# EAGLE design EDUPIC (EAGLE 6.5.0)
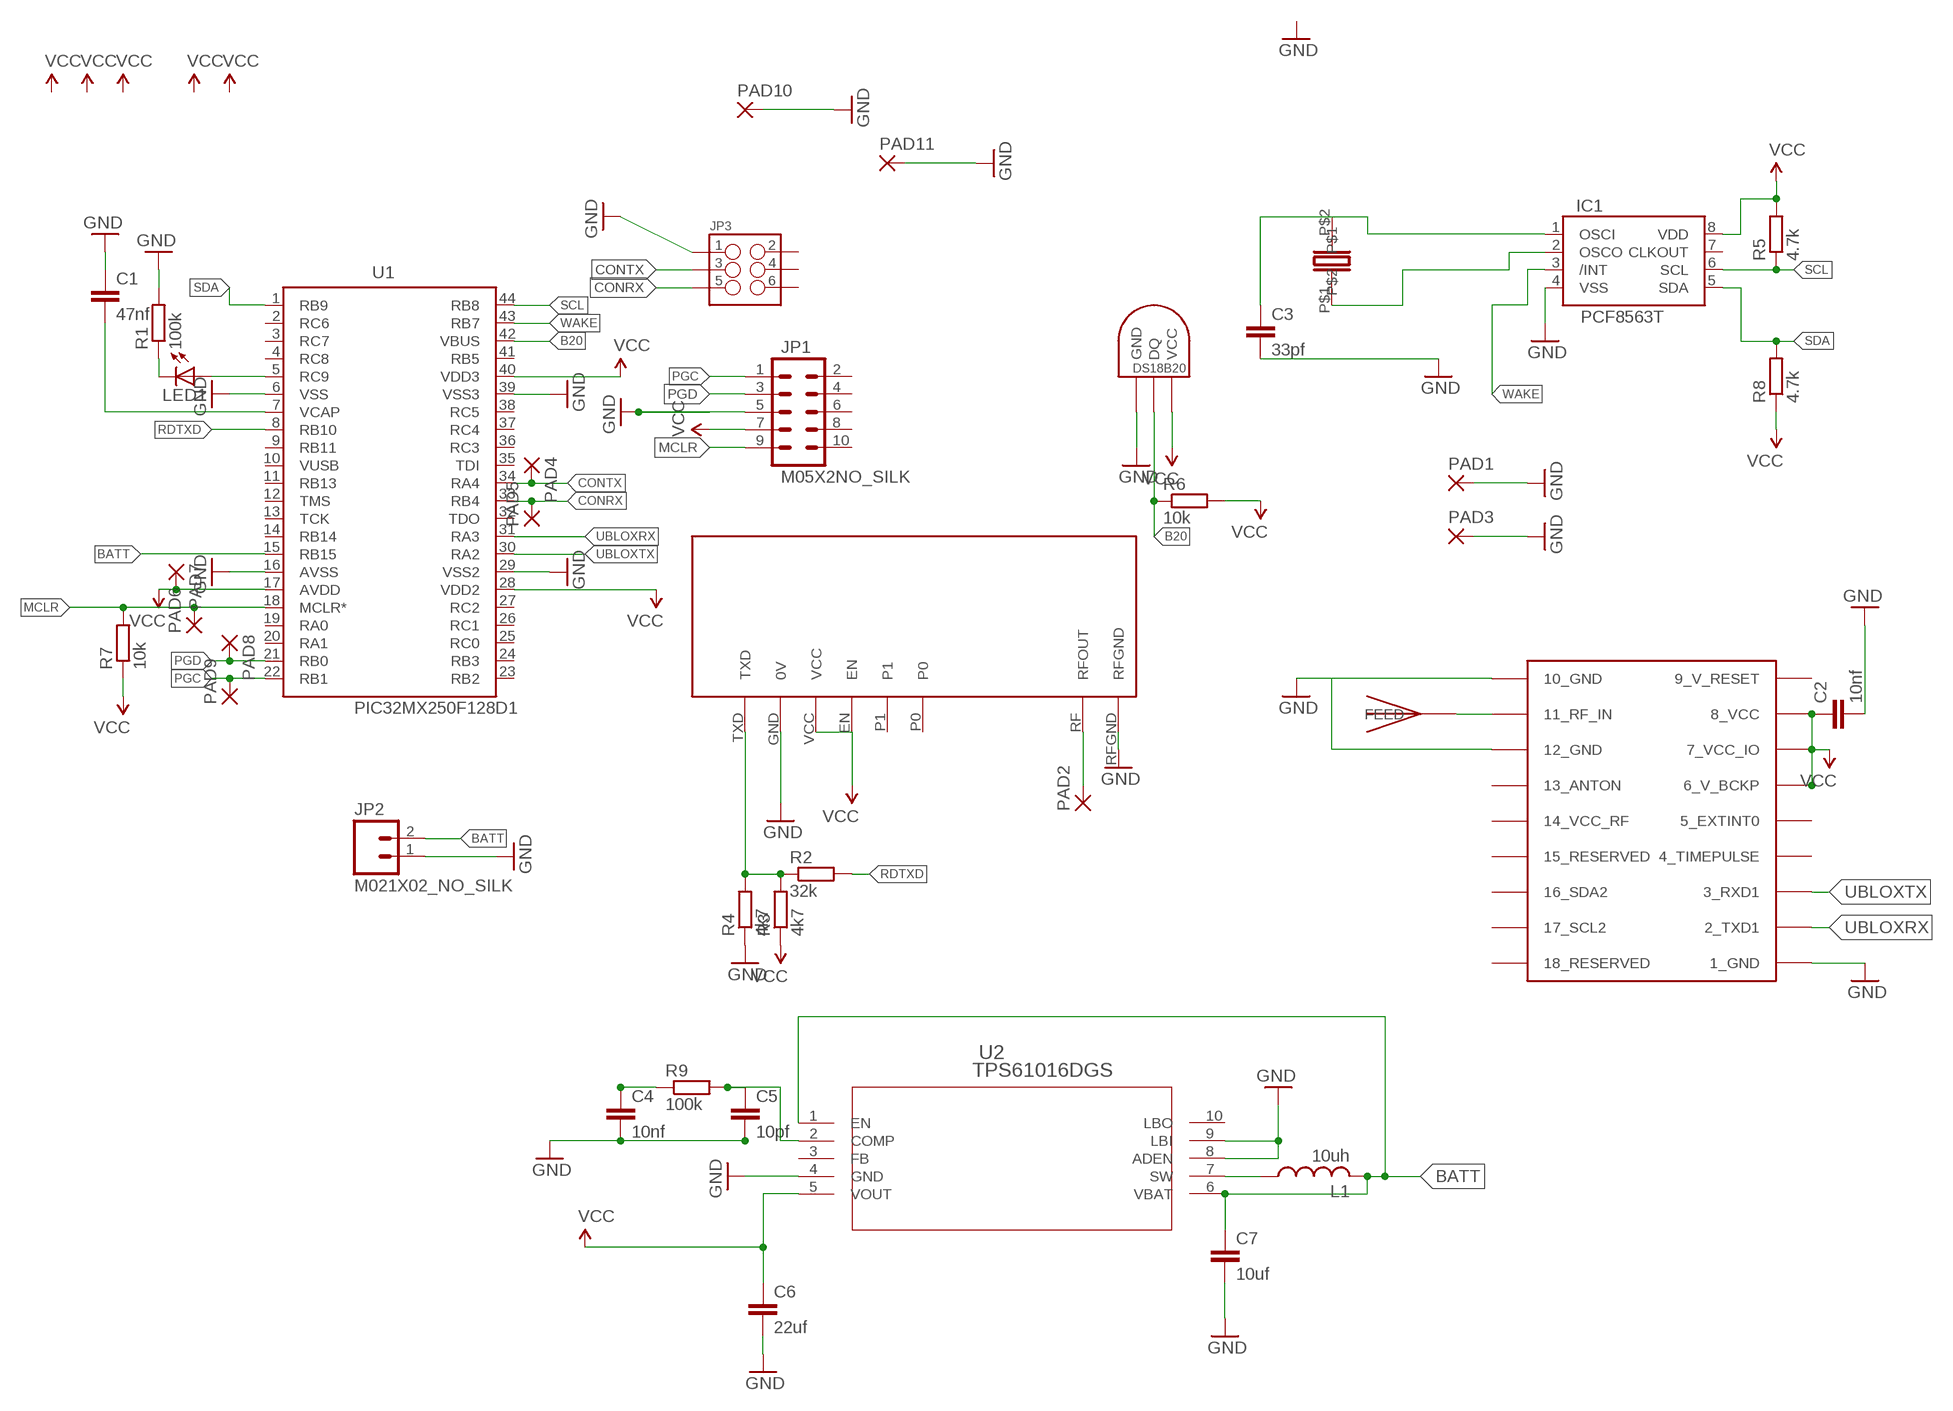
[diagram p0: schematic, sheet 1]

## Parts
C1  47nf  C-EUC1206  [C1206]
C2  10nf  C-EUC1206  [C1206]
C3  33pf  C-EUC0805  [C0805]
C4  10nf  C-EUC0805  [C0805]
C5  10pf  C-EUC0805  [C0805]
C6  22uf  C-EUC1812  [C1812]
C7  10uf  C-EUC1206  [C1206]
IC1  PCF8563T  [SO8]
JP1  M05X2NO_SILK  [2X5_NOSILK]
JP2  M021X02_NO_SILK  [1X02_NO_SILK]
JP3  M03X2NO_SILK  [2X3-NS]
L1  10uh  L-USPIS2816  [PIS2816]
LED1  LEDCHIP-LED0805  [CHIP-LED0805]
PAD1  SMD5  [SMD2,54-5,08]
PAD2  SMD5  [SMD2,54-5,08]
PAD3  SMD5  [SMD2,54-5,08]
PAD4  SMD2  [SMD1,27-2,54]
PAD5  SMD2  [SMD1,27-2,54]
PAD6  SMD2  [SMD1,27-2,54]
PAD7  SMD2  [SMD1,27-2,54]
PAD8  SMD2  [SMD1,27-2,54]
PAD9  SMD2  [SMD1,27-2,54]
PAD10  SMD2  [SMD1,27-2,54]
PAD11  SMD2  [SMD1,27-2,54]
R1  100k  R-EU_R0603  [R0603]
R2  32k  R-EU_R1206  [R1206]
R3  4k7  R-EU_R0805  [R0805]
R4  4k7  R-EU_R0805  [R0805]
R5  4.7k  R-EU_R0603  [R0603]
R6  10k  R-EU_R0603  [R0603]
R7  10k  R-EU_R0603  [R0603]
R8  4.7k  R-EU_R0603  [R0603]
R9  100k  R-EU_R0805  [R0805]
U1  PIC32MX250F128D1  [QFP80P1200X1200X120-44N]
U2  TPS61016DGS  [DGS10]
U$1  RADIOMETRIX-MTX2  [RADIOMETRIX-MTX2]
U$2  DS1820SOIC  [DS18B20_SOIC]
U$3  UBLOX_MAX  [UBLOX_MAX]
U$4  JTI_ANTENNA-1575AT43A40  [JTI_ANTENNA-1575AT43A40]
XTAL  3.2X1.5  [3.2X1.5]

## Nets
B20: R6.1 U1.42(VBUS) U$2.DQ
BATT: C7.1 JP2.2 L1.2 U1.15(RB15) U2.1(EN) U2.6(VBAT)
CONRX: JP3.5 PAD5.1(P) U1.33(RB4)
CONTX: JP3.3 PAD4.1(P) U1.34(RA4)
GND: C1.1 C2.2 C3.2 C4.2 C5.2 C6.2 C7.2 IC1.4(VSS) JP1.5 JP2.1 JP3.1 PAD1.1(P) PAD3.1(P) PAD10.1(P) PAD11.1(P) R1.2 R4.1 U1.6(VSS) U1.16(AVSS) U1.29(VSS2) U1.39(VSS3) U2.4(GND) U2.8(ADEN) U2.9(LBI) U$1.GND(0V) U$1.RFGND U$2.GND U$3.1_GND U$3.10_GND U$3.12_GND
MCLR: JP1.9 PAD6.1(P) R7.2 U1.18(MCLR*)
N$1: R2.1 R3.2 R4.2 U$1.TXD
N$2: LED1.A U1.5(RC9)
N$3: U$3.11_RF_IN U$4.FEED
N$4: IC1.2(OSCO) XTAL.P$1
N$5: PAD2.1(P) U$1.RF(RFOUT)
N$7: LED1.C R1.1
N$8: C3.1 IC1.1(OSCI) XTAL.P$2
N$11: L1.1 U2.7(SW)
N$12: C4.1 R9.1
N$13: C5.1 R9.2 U2.2(COMP)
N$16: C1.2 U1.7(VCAP)
PGC: JP1.1 PAD9.1(P) U1.22(RB1)
PGD: JP1.3 PAD8.1(P) U1.21(RB0)
RDTXD: R2.2 U1.8(RB10)
SCL: IC1.6(SCL) R5.1 U1.44(RB8)
SDA: IC1.5(SDA) R8.2 U1.1(RB9)
UBLOXRX: U1.31(RA3) U$3.2_TXD1
UBLOXTX: U1.30(RA2) U$3.3_RXD1
VCC: C2.1 C6.1 IC1.8(VDD) JP1.7 PAD7.1(P) R3.1 R5.2 R6.2 R7.1 R8.1 U1.17(AVDD) U1.28(VDD2) U1.40(VDD3) U2.5(VOUT) U$1.EN U$1.VCC U$2.VCC U$3.6_V_BCKP U$3.7_VCC_IO U$3.8_VCC
WAKE: IC1.3(/INT) U1.43(RB7)
Unconnected: IC1.7(CLKOUT) JP1.2 JP1.4 JP1.6 JP1.8 JP1.10 JP3.2 JP3.4 JP3.6 U1.2(RC6) U1.3(RC7) U1.4(RC8) U1.9(RB11) U1.10(VUSB) U1.11(RB13) U1.12(TMS) U1.13(TCK) U1.14(RB14) U1.19(RA0) U1.20(RA1) U1.23(RB2) U1.24(RB3) U1.25(RC0) U1.26(RC1) U1.27(RC2) U1.32(TDO) U1.35(TDI) U1.36(RC3) U1.37(RC4) U1.38(RC5) U1.41(RB5) U2.3(FB) U2.10(LBO) U$1.P0 U$1.P1 U$3.4_TIMEPULSE U$3.5_EXTINT0 U$3.13_ANTON U$3.14_VCC_RF U$3.15_RESERVED U$3.16_SDA2 U$3.17_SCL2 U$3.18_RESERVED

## Power pins joined to a net without a drawn wire
9_V_RESET: U$3.9_V_RESET

## Library data of the parts
C1-C7 = rcl:C-EU: CAPACITOR, European symbol
IC1 = nxp:PCF8563
JP1 = SparkFun-Connectors:M05X2: Header 5x2 Standard 10-pin dual row 0.1" header. Commonly used with AVR-ISP. Use with Spark Fun Electronics SKU: PRT-00778
JP2 = SparkFun-Connectors:M02: Standard 2-pin 0.1" header. Use with - straight break away headers ( PRT-00116) - right angle break away headers (PRT-00553) - swiss pins (PRT-00743) - machine pins (PRT-00117) - female headers (PRT-00115) Molex polarized connector foot print use with: PRT-08233 with associated crimp pins and housings. 2.54_SCREWTERM for use with PRT-10571. 3.5mm Screw Terminal footprints for PRT-08084 5mm Screw Terminal footprints for use with PRT-08433
JP3 = SparkFun-Connectors:M03X2: 2x3 .1" header. Shrouded, with keying- CONN-10681 SMT- CONN-11415 Pogo pins- HW-11044
L1 = rcl:L-US: INDUCTOR, American symbol
LED1 = led:LED: LED OSRAM: - CHIPLED LG R971, LG N971, LY N971, LG Q971, LY Q971, LO R971, LY R971 LH N974, LH R974 LS Q976, LO Q976, LY Q976 LO Q996 - Hyper CHIPLED LW Q18S LB Q993, LB Q99A, LB R99A - SideLED LS A670, LO A670, LY A670, LG A670, LP A670 LB A673, LV A673, LT A673, LW A673 LH A674 LY A675 LS A676, LA A676, LO A676, LY A676, LW A676 LS A679, LY A679, LG A679 - Hyper Micro SIDELED® LS Y876, LA Y876, LO Y876, LY Y876 LT Y87S - SmartLED LW L88C, LW L88S LB L89C, LB L89S, LG L890 LS L89K, LO L89K, LY L89K LS L896, LA L896, LO L896, LY L896 - TOPLED LS T670, LO T670, LY T670, LG T670, LP T670 LSG T670, LSP T670, LSY T670, LOP T670, LYG T670 LG T671, LOG T671, LSG T671 LB T673, LV T673, LT T673, LW T673 LH T674 LS T676, LA T676, LO T676, LY T676, LB T676, LH T676, LSB T676, LW T676 LB T67C, LV T67C, LT T67C, LS T67K, LO T67K, LY T67K, LW E67C LS E67B, LA E67B, LO E67B, LY E67B, LB E67C, LV E67C, LT E67C LW T67C LS T679, LY T679, LG T679 LS T770, LO T770, LY T770, LG T770, LP T770 LB T773, LV T773, LT T773, LW T773 LH T774 LS E675, LA E675, LY E675, LS T675 LS T776, LA T776, LO T776, LY T776, LB T776 LHGB T686 LT T68C, LB T68C - Hyper Mini TOPLED® LB M676 - Mini TOPLED Santana® LG M470 LS M47K, LO M47K, LY M47K Source: http://www.osram.convergy.de LUXEON: - LUMILED® LXK2-PW12-R00, LXK2-PW12-S00, LXK2-PW14-U00, LXK2-PW14-V00 LXK2-PM12-R00, LXK2-PM12-S00, LXK2-PM14-U00 LXK2-PE12-Q00, LXK2-PE12-R00, LXK2-PE12-S00, LXK2-PE14-T00, LXK2-PE14-U00 LXK2-PB12-K00, LXK2-PB12-L00, LXK2-PB12-M00, LXK2-PB14-N00, LXK2-PB14-P00, LXK2-PB14-Q00 LXK2-PR12-L00, LXK2-PR12-M00, LXK2-PR14-Q00, LXK2-PR14-R00 LXK2-PD12-Q00, LXK2-PD12-R00, LXK2-PD12-S00 LXK2-PH12-R00, LXK2-PH12-S00 LXK2-PL12-P00, LXK2-PL12-Q00, LXK2-PL12-R00 Source: www.luxeon.com KINGBRIGHT: KA-3528ASYC Source: www.kingbright.com
PAD1-PAD3 = wirepad:SMD5: SMD PAD
PAD4-PAD11 = wirepad:SMD2: SMD PAD
R1-R9 = rcl:R-EU_: RESISTOR, European symbol
U1 = Microchip-PIC32MX1-2-3-4-5-6-7:PIC32MX250F128D: IC,32-bit Microcontrollers (up to 128 KB Flash and 32 KB SRAM) with Audio and Graphics Interfaces, USB, and Advanced Analog,44-Lead QFN
U2 = TPS61016:TPS61016DGS; DESCRIPTION: TPS61016 3.3V 200mA converter, MSOP10; FAMILY: DC to DC Converter and Switching Regulator Chip; MANUFACTURER_NAME: Texas Instruments; MANUFACTURER_PART_NUMBER: TPS61016DGS; RSPARTNUMBER: 5171220; SECTION: Power Management; VENDOR: Texas Instruments
U$1 = Ava:RADIOMETRIX-MTX2
U$2 = Ava:DS1820: DS18B20 Programmable Resolution 1-Wire Digital Thermometer Description The DS18B20 digital thermometer provides 9-bit to 12-bit Celsius temperature measurements and has an alarm function with nonvolatile user-programmable upper and lower trigger points. The DS18B20 communicates over a 1-Wire® bus that by definition requires only one data line (and ground) for communication with a central microprocessor. It has an operating temperature range of -55°C to +125°C and is accurate to ±0.5°C over the range of -10°C to +85°C. In addition, the DS18B20 can derive power directly from the data line ("parasite power"), eliminating the need for an external power supply. Each DS18B20 has a unique 64-bit serial code, which allows multiple DS18B20s to function on the same 1-Wire bus. Thus, it is simple to use one microprocessor to control many DS18B20s distributed over a large area. Applications that can benefit from this feature include HVAC environmental controls, temperature monitoring systems inside buildings, equipment, or machinery, and process monitoring and control systems.
U$3 = Ava:UBLOX_MAX: UBLOX MAX
U$4 = Ava:JTI_ANTENNA-1575AT43A40
XTAL = 3.5x1.5:3.2X1.5

## Board
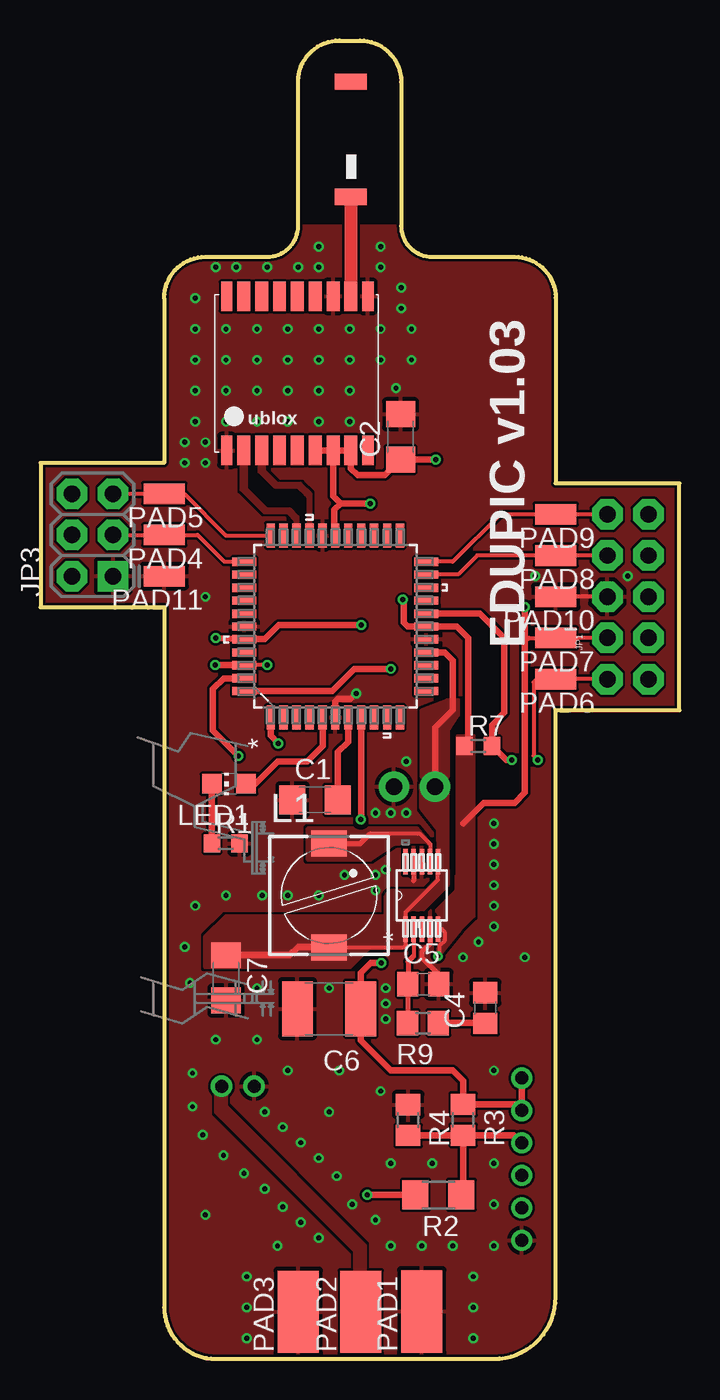
[diagram p1: board, top side]
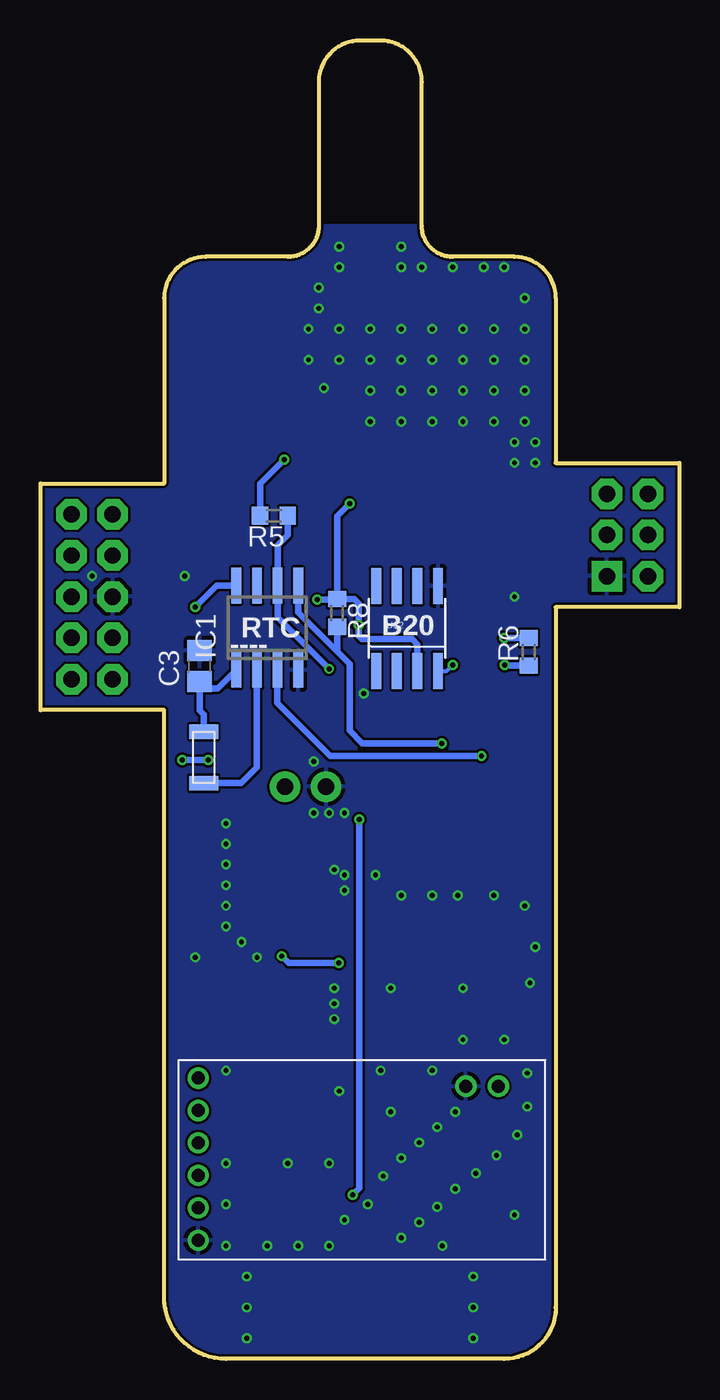
[diagram p2: board, bottom side, seen from below]

Size 39.37 x 81.28 mm. Coordinates in mm from the lower left corner, seen from the top.
Outline: 7.62,65.41 7.62,55.24 0,55.24 0,46.35 7.62,46.35 7.62,3.17 arc90 10.79,0 27.94,0 arc90 31.75,3.81 31.75,40.01 39.37,40.01 39.37,53.98 31.75,53.98 31.75,65.41 arc90 29.21,67.95 24.13,67.95 arc-90 22.23,69.85 22.23,78.74 arc90 19.69,81.28 18.41,81.28 arc90 15.88,78.74 15.88,69.85 arc-90 13.97,67.95 10.16,67.95 arc90 7.62,65.41
Copper layers (1*16): Top 0.035mm / dielectric 1.5mm / Bottom 0.035mm
Design rules "hackvana": minimum track width 6mil, minimum drill 0.3mm, track to track 6mil, track to pad 6mil, pad to pad 6mil, via to via 6mil, smd to smd 0mil, copper to edge 6mil, drill to drill 6mil, minimum pad ring 10mil, minimum via ring 6mil, stop-mask expansion 2mil, vias tented up to drill 100mil, thermal gap 10mil

### Footprints (pad centres in the part's own frame; a part is rotated, then mirrored left to right if it is on the bottom)
C1206 = smd 1.6 x 1.8: 1 -1.4,0; 2 1.4,0
C0805 = smd 1.3 x 1.5: 1 -0.95,0; 2 0.95,0
C1812 = smd 1.9 x 3.4: 1 -1.95,0; 2 1.95,0
SO8 = smd 0.6 x 2.2: 1 -1.905,-2.6; 2 -0.635,-2.6; 3 0.635,-2.6; 4 1.905,-2.6; 5 1.905,2.6; 6 0.635,2.6; 7 -0.635,2.6; 8 -1.905,2.6
2X5_NOSILK = drill 1.016 pad 1.88 octagon: 1 -1.27,5.08; 2 1.27,5.08; 3 -1.27,2.54; 4 1.27,2.54; 5 -1.27,0; 6 1.27,0; 7 -1.27,-2.54; 8 1.27,-2.54; 9 -1.27,-5.08; 10 1.27,-5.08
1X02_NO_SILK = drill 1.016 pad 1.88: 1 0,0; 2 2.54,0
2X3-NS = drill 1.016 pad 1.88 square: 1 -2.54,-1.27 | drill 1.016 pad 1.88 octagon: 2 -2.54,1.27; 3 0,-1.27; 4 0,1.27; 5 2.54,-1.27; 6 2.54,1.27
PIS2816 = smd 2.2 x 1.6: 1 0,3.2; 2 0,-3.2
CHIP-LED0805 = smd 1.2 x 1.2: A 0,-1.05; C 0,1.05
SMD2,54-5,08 = smd 2.54 x 5.08: 1 0,0
SMD1,27-2,54 = smd 1.27 x 2.54: 1 0,0
R0603 = smd 1 x 1.1: 1 -0.85,0; 2 0.85,0
R1206 = smd 1.6 x 1.803: 1 -1.422,0; 2 1.422,0
R0805 = smd 1.3 x 1.5: 1 -0.95,0; 2 0.95,0
QFP80P1200X1200X120-44N = smd 1.473 x 0.508: 1 -5.613,3.988; 2 -5.613,3.2; 3 -5.613,2.388; 4 -5.613,1.6; 5 -5.613,0.787; 6 -5.613,0; 7 -5.613,-0.787; 8 -5.613,-1.6; 9 -5.613,-2.388; 10 -5.613,-3.2; 11 -5.613,-3.988; 23 5.613,-3.988; 24 5.613,-3.2; 25 5.613,-2.388; 26 5.613,-1.6; 27 5.613,-0.787; 28 5.613,0; 29 5.613,0.787; 30 5.613,1.6; 31 5.613,2.388; 32 5.613,3.2; 33 5.613,3.988 | smd 0.508 x 1.473: 12 -3.988,-5.613; 13 -3.2,-5.613; 14 -2.388,-5.613; 15 -1.6,-5.613; 16 -0.787,-5.613; 17 0,-5.613; 18 0.787,-5.613; 19 1.6,-5.613; 20 2.388,-5.613; 21 3.2,-5.613; 22 3.988,-5.613; 34 3.988,5.613; 35 3.2,5.613; 36 2.388,5.613; 37 1.6,5.613; 38 0.787,5.613; 39 0,5.613; 40 -0.787,5.613; 41 -1.6,5.613; 42 -2.388,5.613; 43 -3.2,5.613; 44 -3.988,5.613
DGS10 = smd 1.575 x 0.279: 1 -2.083,0.991; 2 -2.083,0.508; 3 -2.083,0; 4 -2.083,-0.508; 5 -2.083,-0.991; 6 2.083,-0.991; 7 2.083,-0.508; 8 2.083,0; 9 2.083,0.508; 10 2.083,0.991
RADIOMETRIX-MTX2 = drill 0.8: EN 9.97,-3.25; GND 9.97,4.75; P0 9.97,2.75; P1 9.97,0.75; RF -8.53,-4.75; RFGND -6.53,-4.75; TXD 9.97,-1.25; VCC 9.97,-5.25
DS18B20_SOIC = smd 0.61 x 2.21: DQ 1.905,-2.616; GND 1.905,2.616; NC -1.905,-2.616; NC2 -0.635,-2.616; NC3 -1.905,2.616; NC4 -0.635,2.616; NC5 0.635,2.616; VCC 0.635,-2.616
UBLOX_MAX = smd 1.8 x 0.7: 1_GND 4.95,-4.4; 9_V_RESET 4.95,4.3; 10_GND -4.55,4.3; 18_RESERVED -4.55,-4.4 | smd 1.8 x 0.8: 2_TXD1 4.95,-3.35; 3_RXD1 4.95,-2.25; 4_TIMEPULSE 4.95,-1.15; 5_EXTINT0 4.95,-0.05; 6_V_BCKP 4.95,1.05; 7_VCC_IO 4.95,2.15; 8_VCC 4.95,3.25; 11_RF_IN -4.55,3.25; 12_GND -4.55,2.15; 13_ANTON -4.55,1.05; 14_VCC_RF -4.55,-0.05; 15_RESERVED -4.55,-1.15; 16_SDA2 -4.55,-2.25; 17_SCL2 -4.55,-3.35
JTI_ANTENNA-1575AT43A40 = smd 1 x 2: FEED -3.175,0; NC 3.925,0
3.2X1.5 = smd 0.914 x 1.778: P$1 -1.905,0; P$2 1.27,0

### Placement (x,y rotation side)
C1  16.92,34.47 0 top
C2  22.19,56.85 90 top
C3  29.57,42.71 90 bottom
C4  27.4,21.63 90 top
C5  23.59,23.11 0 top
C6  17.78,21.59 180 top
C7  11.43,23.49 270 top
IC1  25.4,45.09 0 bottom
JP1  36.2,46.99 0 top
JP2  21.78,35.28 0 top
JP3  3.2,50.8 90 top
L1  17.78,28.57 0 top
LED1  11.61,35.46 90 top
PAD1  23.49,2.94 0 top
PAD2  19.74,2.91 0 top
PAD3  15.88,2.91 0 top
PAD4  7.62,50.8 90 top
PAD5  7.62,53.34 90 top
PAD6  31.75,41.91 90 top
PAD7  31.75,44.45 90 top
PAD8  31.75,49.53 90 top
PAD9  31.75,52.07 90 top
PAD10  31.75,46.99 90 top
PAD11  7.62,48.26 90 top
R1  11.41,31.78 0 top
R2  24.52,10.11 180 top
R3  26.04,14.75 270 top
R4  22.65,14.73 270 top
R5  24.99,51.99 180 bottom
R6  9.28,43.59 90 bottom
R7  26.97,37.79 0 top
R8  21.09,45.99 270 bottom
R9  23.56,20.71 180 top
U1  18.17,45.16 90 top
U2  23.49,28.57 90 top
U$1  19.69,12.07 180 bottom
U$2  16.78,45.04 0 bottom
U$3  15.88,60.96 270 top
U$4  19.12,74.81 90 top
XTAL  29.31,37.4 90 bottom

### Tracks (layer width: path | path; a pad name or v marks a point on that pad's centre or on a via)
B20  (via drill 0.3)
  Top 0.254: v13.97,42.77 U1.42
  Top 0.406: v10.77,42.78 12.54,42.78 U1.42
  Bottom 0.254: U$2.DQ 14.32,42.42 v13.97,42.77
  Bottom 0.406: R6.1 10.73,42.74 v10.77,42.78
BATT
  Top 0.254: U2.1 | L1.2 22.36,25.38 22.51,25.53 U2.1 | U2.1 22.5,27.56 24.48,29.54 U2.6
  Top 0.406: C7.1 15.37,24.89 15.88,25.4 17.75,25.4 L1.2 | JP2.2 24.32,38.92 25.4,40.01 25.4,43.07 24.91,43.56 U1.15 | U1.15
  pour Top (isolate 0.305, no thermals): 10.16,24.13 10.16,26.04 11.43,27.3 22.54,27.3 22.54,25.4 20.32,25.4 19.05,24.13
  pour Top (isolate 0.305, no thermals): 24.45,30.16 25.08,30.16 25.08,29.21 23.49,27.62 22.54,27.62 22.23,27.62 21.91,27.3 21.27,27.3 21.27,28.57 21.59,28.89 23.81,28.89 24.45,29.53
  pour Top (no thermals): 21.91,27.94 21.91,27.3 22.54,27.3 22.54,27.94
  pour Top (isolate 0.305, no thermals): 23.49,35.88 23.49,40.01 25.08,40.64 25.72,40.64 25.72,39.69 25.08,38.73 25.08,35.88
  pour Top (isolate 0.254, no thermals): 24.5,29.99 24.5,32.6 23.47,33.95 23.47,35.46 25.06,35.46 25.06,29.99
CONRX
  Top 0.254: JP3.5 PAD5.1 8.84,53.34 11.41,50.77 U1.33
CONTX
  Top 0.254: U1.34 11.32,49.15 9.67,50.8 PAD4.1 JP3.3
GND  (via drill 0.3)
  Top 0.254: JP1.5 PAD10.1
  Top 0.305: U2.9 22.99,29.49 | U2.4 24,25.59 23.49,25.08 23.49,24.77 24.45,23.81 24.45,23.2 C5.2
  Top 0.406: U1.6 18.17,40.54 18.31,40.68 19.1,40.68 v19.45,41.03
  other vias: 9.52,63.5 11.43,63.5 13.34,63.5 15.24,63.5 17.14,63.5 19.05,63.5 20.95,63.5 9.52,61.59 11.43,61.59 13.34,61.59 15.24,61.59 17.14,61.59 19.05,61.59 20.95,61.59 9.52,59.69 11.43,59.69 13.34,59.69 15.24,59.69 17.14,59.69 19.05,59.69 11.43,57.78 13.34,57.78 15.24,57.78 17.14,57.78 19.05,57.78 9.52,57.78 9.52,65.41 10.16,56.52 10.16,55.24 8.89,56.52 8.89,55.24 10.16,46.99 30.48,48.26 11.43,28.57 29.84,24.77 10.79,19.68 12.7,5.08 12.7,3.17 12.7,1.27 14.61,6.99 21.59,6.99 23.49,6.99 25.4,6.99 26.67,5.08 26.67,3.17 26.67,1.27 17.78,15.24 10.16,8.89 27.94,12.07 27.94,9.53 27.94,6.99 21.59,12.07 20.95,16.51 27.94,17.78 15.24,17.78 18.41,17.78 24.13,12.07 36.2,48.26 20.95,67.31 20.95,68.58 17.14,68.58 17.14,67.31 15.88,67.31 13.97,67.31 12.06,67.31 10.79,67.31 22.23,66.04 22.23,64.77 22.54,33.66 21.59,33.66 20.64,33.66 21.27,30.16 21.27,22.86 21.27,21.91 21.27,20.95 20.64,29.84 20.64,28.89 18.73,29.84 13.34,22.86 17.78,22.86 9.21,23.18 8.89,25.4 9.52,27.94 13.65,28.57 15.24,28.57 17.14,28.57 27.94,33.02 27.94,31.75 27.94,30.48 27.94,29.21 27.94,27.94 27.94,26.67 26.99,25.72 26.03,24.77 10,13.81 11.27,12.55 12.54,11.44 13.81,10.48 14.92,9.37 16.03,8.42 17.14,7.47 13.81,15.24 14.92,14.29 16.03,13.34 17.14,12.39 18.25,11.28 20.64,8.57 19.21,9.52 9.37,15.56 9.37,17.62 13.34,19.68 22.86,63.5 22.86,61.59 21.91,59.85 22.54,36.83
  pour Bottom: 15.87,69.84 22.22,69.84 22.23,69.85 arc90 24.13,67.95 29.21,67.95 arc-90 31.75,65.41 31.75,53.98 39.37,53.98 39.37,40.01 31.75,40.01 31.75,3.81 arc-90 27.94,0 10.79,0 arc-90 7.62,3.17 7.62,46.35 0,46.35 0,55.24 7.62,55.24 7.62,65.41 arc-90 10.16,67.95 13.97,67.95 arc90 15.88,69.85
  pour Top (rank 4): 10.79,0 arc-90 7.62,3.17 7.62,46.35 0,46.35 0,55.24 7.62,55.24 7.62,65.41 arc-90 10.16,67.95 13.97,67.95 arc90 15.88,69.85 15.87,69.84 22.22,69.84 22.23,69.85 arc90 24.13,67.95 29.21,67.95 arc-90 31.75,65.41 31.75,53.98 39.37,53.98 39.37,40.01 31.75,40.01 31.75,3.81 arc-90 27.94,0
MCLR  (via drill 0.3)
  Top 0.254: v30.64,36.92 30.38,37.18 30.38,41.72 30.57,41.91 PAD6.1 JP1.9
  Top 0.406: U1.18 27.08,45.95 28.57,44.45 28.57,39.84 27.82,39.09 R7.2 28.69,36.92 v29.04,36.92
  Bottom 0.406: v30.64,36.92 v29.04,36.92
N$1
  Top 0.406: R3.2 29.17,13.8 U$1.TXD | R3.2 26.04,10.21 R2.1 | R4.2 26.02,13.78 R3.2
N$2
  Top 0.406: LED1.A 13.23,35.46 14.61,36.83 16.44,36.83 17.39,37.78 17.39,39.54 U1.5
N$3
  Top 0.813: U$4.FEED U$3.11_RF_IN
N$4
  Bottom 0.406: IC1.2 26.03,36.47 26.99,35.51 29.3,35.51 XTAL.P$1
N$5
  Top 0.813: 20.32,1.27 PAD2.1
  pour Top (isolate 0.406, no thermals): 10.79,16.83 10.79,15.24 19.37,6.67 19.37,4.76 20,4.76 20,6.99 11.43,15.56 11.43,16.83
N$7
  Top 0.406: LED1.C R1.1
N$8
  Bottom 0.406: IC1.1 27.3,42.46 28.44,41.32 29.56,41.32 C3.1 29.57,39.98 29.32,39.74 XTAL.P$2
N$11
  Top 0.254: 20.32,32.38 23.36,32.38 23.98,31.77 24,31.77 U2.7
  Top 0.305: L1.1 19.71,31.77 20.32,32.38
  pour Top (isolate 0.305, no thermals): 16.51,32.7 23.16,32.7 23.91,31.77 21.79,31.77 20.31,30.78 16.52,30.78 16.51,30.8
N$12
  Top 0.305: 27.38,20.71 C4.1
  Top 0.406: R9.1 27.38,20.71
N$13
  Top 0.254: U2.2 22.99,24.84
  Top 0.305: 22.99,24.84 22.65,24.5 C5.1 22.64,20.74 R9.2
N$16
  Top 0.406: C1.2 18.32,37.42 18.95,38.05 U1.7
PGC
  Top 0.254: U1.22 25.4,49.15 28.32,52.07 PAD9.1 JP1.1
PGD
  Top 0.254: U1.21 25.73,48.36 26.9,49.53 PAD8.1 JP1.3
RDTXD  (via drill 0.3)
  Top 0.406: U1.8 19.77,33.29 v19.73,33.26 | v20.13,10.12 R2.2
  Bottom 0.406: v19.73,33.26 19.73,10.51 v20.13,10.12
SCL  (via drill 0.3)
  Top 0.406: v21.59,42.55 19.34,42.55 17.96,41.17 U1.44
  Bottom 0.406: 24.78,47.7 IC1.6 | IC1.6 24.77,45.72 v21.59,42.55 | R5.1 24.14,50.79 24.77,50.16 IC1.6
SDA  (via drill 0.3)
  Top 0.406: U1.1 14.18,38.42 v14.65,37.95
  Bottom 0.406: v14.65,37.95 19.54,37.95 20.32,38.73 20.32,42.85 21.12,43.65 | 21.12,43.65 23.49,46.02 IC1.5 | R8.2 21.09,43.68 21.12,43.65
UBLOXRX
  pour Top (isolate 0.254, no thermals): 12.37,56.16 12.37,53.63 13.79,52.2 15.22,52.2 15.7,51.72 15.7,50.77 15.86,50.77 15.86,51.88 15.38,52.36 13.95,52.36 12.68,53.63 12.68,56.16 12.52,56.16
UBLOXTX
  pour Top (isolate 0.254, no thermals): 13.48,56.16 13.48,54.74 14.43,53.78 15.86,53.78 16.33,53.31 16.49,53.15 16.49,50.77 16.65,50.77 16.65,53.31 16.02,53.94 14.59,53.94 13.79,54.74 13.79,56.16 13.64,56.16
VCC  (via drill 0.3)
  Top 0.254: 29.84,44.19 30.11,44.45 PAD7.1 JP1.7 | 24.5,26.48 U2.5 24.74,26.49 24.9,26.34 24.9,25.78 24.58,25.46 24.58,24.91 v24.5,24.83
  Top 0.305: 26.03,37.7 R7.1
  Top 0.406: U$3.6_V_BCKP U$3.7_VCC_IO | U$3.7_VCC_IO U$3.8_VCC 19.12,54.9 19.54,54.48 21.22,54.48 C2.1 v24.36,55.44 | U$1.VCC U$1.EN 29.27,15.7 R3.1 26.03,17.14 25.4,17.78 21.59,17.78 19.73,19.64 C6.1 19.73,23.8 20.36,24.42 v21,24.42 | U$3.7_VCC_IO 18.03,53.2 18.49,52.74 | v20.32,52.74 18.49,52.74 | 18.49,52.74 18.11,52.36 18.11,50.83 U1.28 | v22.32,46.81 22.4,46.74 22.4,45.41 22.64,45.16 U1.17 25.64,45.16 26.35,44.45 26.35,38.02 R7.1 | v19.76,45.25 14.68,45.25 13.81,44.38 12.56,44.38 U1.40 v10.79,44.45 | v29.84,46.35 29.84,44.19 29.84,34.92 29.21,34.29 27.3,34.29 26.03,33.02
  Bottom 0.406: R8.1 21.09,51.97 v20.32,52.74 | v22.32,46.81 21.12,46.81 R8.1 | R8.1 20.02,46.84 19.76,46.58 v19.76,45.25 19.76,44.56 19.59,44.38 16.47,44.38 16.15,44.06 U$2.VCC | IC1.8 28.52,47.69 v29.84,46.35 | v10.79,44.45 R6.2 | v21,24.42 24.09,24.42 v24.5,24.83 | R5.2 25.84,53.96 v24.36,55.44
  pour Top (isolate 0.305, rank 3, no thermals): 24.45,25.72 24.45,28.57 25.72,29.84 25.72,38.42 26.35,38.42 26.67,38.42 26.67,27.3 25.08,25.72
  pour Top (isolate 0.305, no thermals): 24.5,24.83 24.5,26.5 25.85,26.5
WAKE  (via drill 0.3)
  Top 0.406: U1.43 11.29,41.96 10.62,41.3 10.62,38.75 v12.2,37.18
  Bottom 0.406: v12.2,37.18 21.52,37.18 24.78,40.44 24.78,42.47 IC1.3

### Text on the board
tPlace: EDUPIC v1.03
bPlace: B20 | RTC | ----